# Altium project AllStudentItem.PrjPcb
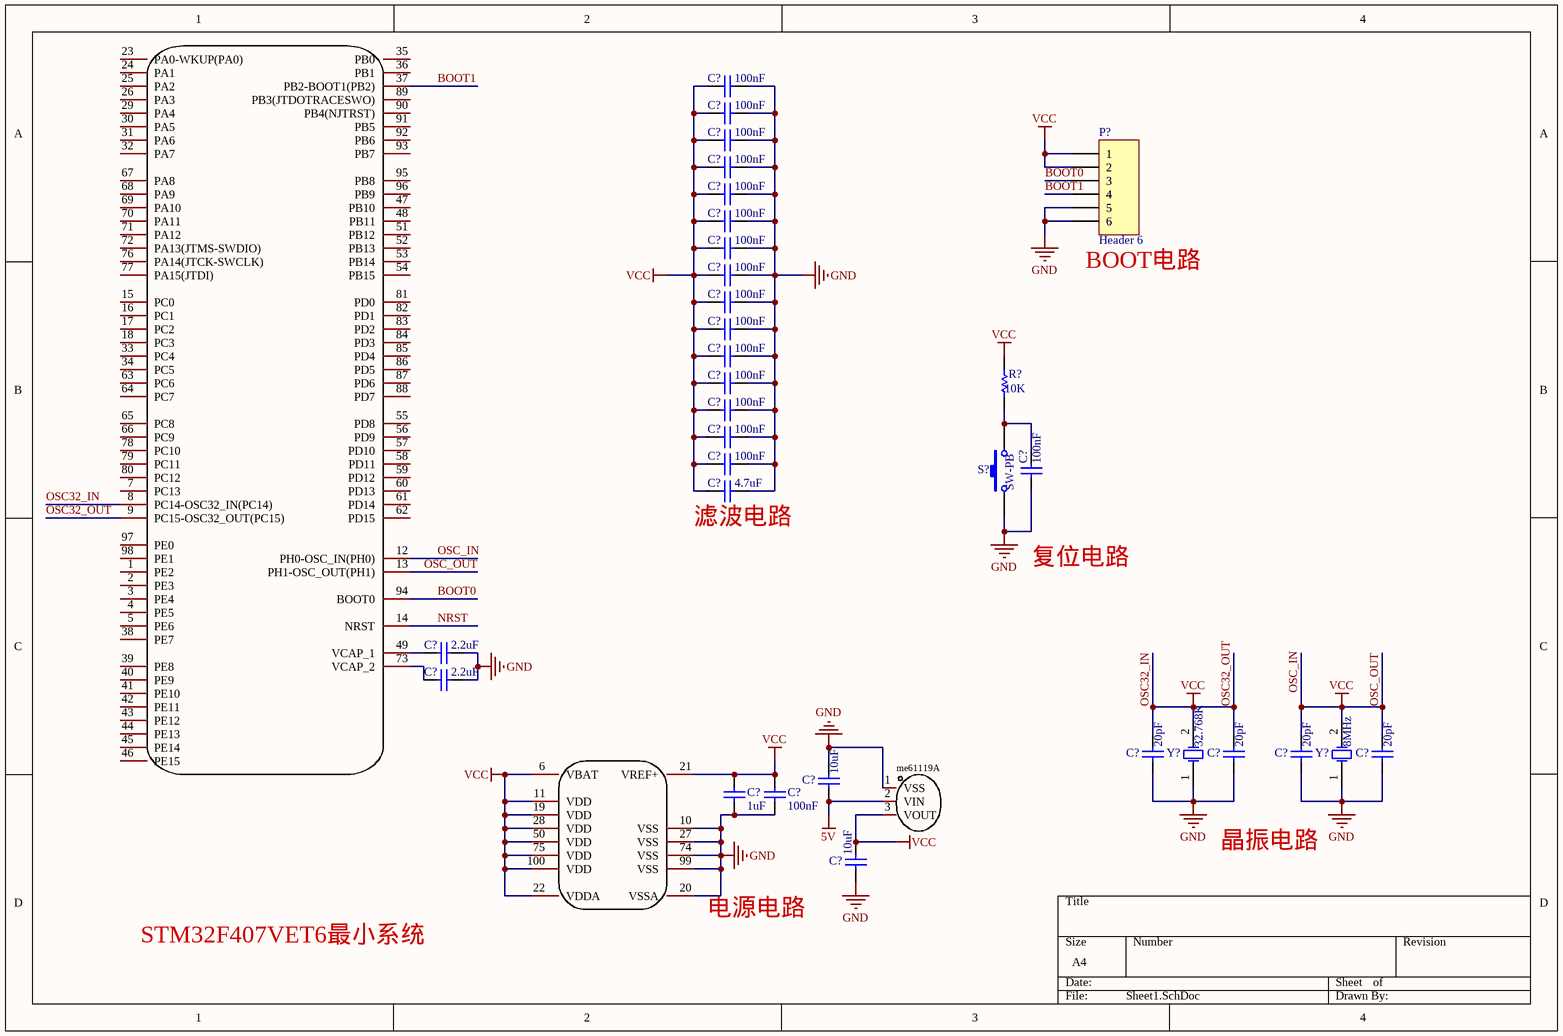
[diagram p0: Sheet1.SchDoc]
1 sheet, 35 parts. Net scope: global (net labels, ports and power ports of the same name join across sheets).
Board file: PCB1.PcbDoc

## Sheet Sheet1.SchDoc
size A4

### Parts
(Parts that share a designator on the sheet are numbered #1, #2 ... from top to bottom, then left to right.)
C?#1  100nF  [RAD-0.3]
C?#2  100nF  [RAD-0.3]
C?#3  100nF  [RAD-0.3]
C?#4  100nF  [RAD-0.3]
C?#5  100nF  [RAD-0.3]
C?#6  100nF  [RAD-0.3]
C?#7  100nF  [RAD-0.3]
C?#8  100nF  [RAD-0.3]
C?#9  100nF  [RAD-0.3]
C?#10  100nF  [RAD-0.3]
C?#11  100nF  [RAD-0.3]
C?#12  100nF  [RAD-0.3]
C?#13  100nF  [RAD-0.3]
C?#14  100nF  [RAD-0.3]
C?#15  100nF  [RAD-0.3]
C?#16  4.7uF  [RAD-0.3]
C?#17  100nF  [RAD-0.3]
C?#18  2.2uF  [RAD-0.3]
C?#19  2.2uF  [RAD-0.3]
C?#20  20pF  [RAD-0.3]
C?#21  20pF  [RAD-0.3]
C?#22  20pF  [RAD-0.3]
C?#23  20pF  [RAD-0.3]
C?#24  10uF  [RAD-0.3]
C?#25  1uF  [RAD-0.3]
C?#26  100nF  [RAD-0.3]
C?#27  10uF  [RAD-0.3]
LDO??  ME6119A33PG  [SOT-89-3_L4.5-W2.5-P1.50-LS4.2-BR]  (value not drawn)
P?  Header 6  [HDR1X6]
R?  value 10K  [AXIAL-0.3]  (hidden comment: Res1)
S?  SW-PB  [SPST-2]
U?#1  STM32F407VET6  [LQFP-100_L14.0-W14.0-P0.50-LS16.0-BL]  (value not drawn)  (part A of 2)
U?#2  STM32F407VET6  [LQFP-100_L14.0-W14.0-P0.50-LS16.0-BL]  (value not drawn)  (part B of 2)
Y?#1  32.768K  [R38]
Y?#2  8MHz  [R38]

### Nets
5V: C?#24.1 LDO??.2(VIN)
GND: C?#1.2 C?#2.2 C?#3.2 C?#4.2 C?#5.2 C?#6.2 C?#7.2 C?#8.2 C?#9.2 C?#10.2 C?#11.2 C?#12.2 C?#13.2 C?#14.2 C?#15.2 C?#16.2 C?#17.1 C?#18.2 C?#19.2 C?#20.1 C?#21.1 C?#22.1 C?#23.1 C?#24.2 C?#25.1 C?#26.1 C?#27.1 LDO??.1(VSS) P?.5 P?.6 S?.1 U?#2.10(VSS) U?#2.20(VSSA) U?#2.27(VSS) U?#2.74(VSS) U?#2.99(VSS) Y?#1.1(OSC1) Y?#2.1(OSC1)
OSC32_IN: C?#1.1 C?#2.1 C?#3.1 C?#4.1 C?#5.1 C?#6.1 C?#7.1 C?#8.1 C?#9.1 C?#10.1 C?#11.1 C?#12.1 C?#13.1 C?#14.1 C?#15.1 C?#16.1 C?#20.2 C?#21.2 C?#22.2 C?#23.2 C?#25.2 C?#26.2 C?#27.2 LDO??.3(VOUT) P?.1 P?.2 R?.2 U?#1.8(PC14-OSC32_IN(PC14)) U?#1.9(PC15-OSC32_OUT(PC15)) U?#1.12(PH0-OSC_IN(PH0)) U?#1.13(PH1-OSC_OUT(PH1)) U?#2.6(VBAT) U?#2.11(VDD) U?#2.19(VDD) U?#2.21(VREF+) U?#2.22(VDDA) U?#2.28(VDD) U?#2.50(VDD) U?#2.75(VDD) U?#2.100(VDD) Y?#1.2(OSC2) Y?#2.2(OSC2)  [also labelled OSC32_OUT, OSC_IN, OSC_OUT, VCC]
BOOT0: P?.3 U?#1.94(BOOT0)
BOOT1: P?.4 U?#1.37(PB2-BOOT1(PB2))
NRST: U?#1.14(NRST)
NetC?#17_2: C?#17.2 R?.1 S?.2
NetC?#18_1: C?#18.1 U?#1.49(VCAP_1)
NetC?#19_1: C?#19.1 U?#1.73(VCAP_2)

Not connected (* = marked no-connect by the designer): U?#1 1(PE2) 2(PE3) 3(PE4) 4(PE5) 5(PE6) 7(PC13) 15(PC0) 16(PC1) 17(PC2) 18(PC3) 23(PA0-WKUP(PA0)) 24(PA1) 25(PA2) 26(PA3) 29(PA4) 30(PA5) 31(PA6) 32(PA7) 33(PC4) 34(PC5) 35(PB0) 36(PB1) 38(PE7) 39(PE8) 40(PE9) 41(PE10) 42(PE11) 43(PE12) 44(PE13) 45(PE14) 46(PE15) 47(PB10) 48(PB11) 51(PB12) 52(PB13) 53(PB14) 54(PB15) 55(PD8) 56(PD9) 57(PD10) 58(PD11) 59(PD12) 60(PD13) 61(PD14) 62(PD15) 63(PC6) 64(PC7) 65(PC8) 66(PC9) 67(PA8) 68(PA9) 69(PA10) 70(PA11) 71(PA12) 72(PA13(JTMS-SWDIO)) 76(PA14(JTCK-SWCLK)) 77(PA15(JTDI)) 78(PC10) 79(PC11) 80(PC12) 81(PD0) 82(PD1) 83(PD2) 84(PD3) 85(PD4) 86(PD5) 87(PD6) 88(PD7) 89(PB3(JTDOTRACESWO)) 90(PB4(NJTRST)) 91(PB5) 92(PB6) 93(PB7) 95(PB8) 96(PB9) 97(PE0) 98(PE1)

### Notes on the sheet
- (near P?) BOOT电路
- (near C?#16) 滤波电路
- 复位电路
- (near LDO??) Text
- 晶振电路
- (near U?#2) 电源电路
- STM32F407VET6最小系统
- (in symbol ME6119A33PG) me61119A

### Library data of the parts
C?#1-C?#27 = Cap: Capacitor; Published: 8-Jun-2000; LatestRevisionDate: 17-Jul-2002; LatestRevisionNote: Re-released for DXP Platform.; PackageReference: RAD-0.3; Publisher: Altium Limited; PackageDescription: Radial Cap, Thru-Hole; 2 Leads; 0.3 in Pin Spacing
LDO?? = ME6119A33PG: Manufacturer: MICRONE(南京微盟); Add into BOM: yes; Output Type: 固定; Maximum Input Voltage: 18V; Output Voltage: 3.3V; MAX Output Current: 400mA; Dropout Voltage: 260mV@(200mA); Output Polarity: 正极; Number of Outputs: 1; Symbol: ME6119A33PG; Device: ME6119A33PG; LCSC Part Name: 输入18V 输出3.3V 400mA; Supplier Part: C82566; Manufacturer Part: ME6119A33PG; Supplier Footprint: SOT-89-3; JLCPCB Part Class: Extended Part; Datasheet: https://atta.szlcsc.com/upload/public/pdf/source/20161024/1477288459592.pdf; Supplier: LCSC; Convert to PCB: yes; Power Supply Rejection Ratio (PSRR): -
P? = Header 6: Header, 6-Pin; LatestRevisionDate: 17-Jul-2002; LatestRevisionNote: Re-released for DXP Platform.; Publisher: Altium Limited
R? = Res1: Resistor; Published: 8-Jun-2000; LatestRevisionDate: 17-Jul-2002; LatestRevisionNote: Re-released for DXP Platform.; PackageReference: AXIAL-0.3; Publisher: Altium Limited; PackageDescription: Axial Device, Thru-Hole; 2 Leads; 0.3 in Pin Spacing
S? = SW-PB: Switch; Published: 24-Mar-1999; LatestRevisionDate: 17-Jul-2002; LatestRevisionNote: Re-released for DXP Platform.; PackageReference: SPST-2; Publisher: Altium Limited; PackageDescription: Switch; 2 Leads
U?#1 U?#2 = STM32F407VET6: Manufacturer: ST(意法半导体); Add into BOM: yes; CPU Core: CM4; Program Storage Size: 512KB; RAM Size: 192KB; GPIO Ports Number: 82; Operating Voltage Range: 1.8V~3.6V; CPU Maximum Speed: 168MHz; Program Memory Type: FLASH; ADC (Bit): 12bit; Universal Serial Bus: 有; Peripheral/Function: DMA；LCD/LED驱动；PWM; Symbol: STM32F407VET6; Device: STM32F407VET6; LCSC Part Name: STM32F407VET6; Supplier Part: C28730; Manufacturer Part: STM32F407VET6; Supplier Footprint: LQFP-100(14x14); JLCPCB Part Class: Extended Part; Datasheet: https://atta.szlcsc.com/upload/public/pdf/source/20140801/1457707197138.pdf; Supplier: LCSC; Convert to PCB: yes; Operating Temperature Range: -40℃~+85℃; DAC (Bit): 12bit; PWM (Bit): -; Internal Comparator: -; communication protocol: -; Watchdog: 有; Real-Time Clock: -; Infrared Data Association: 有; Low-Voltage Detect: 有; CCP Capture/Compare: -; LCD Module: 有; Secure Digital Input and Output: -; Direct Memory Access: 有; Internal Oscillator: 有
Y?#1 Y?#2 = XTAL: Crystal Oscillator; Published: 8-Jun-2000; LatestRevisionDate: 17-Jul-2002; LatestRevisionNote: Re-released for DXP Platform.; PackageReference: R38; Publisher: Altium Limited; PackageDescription: Crystal, Thru-Hole; 2 Leads; Body 3.1 x 8.2 mm (Dia.xH)